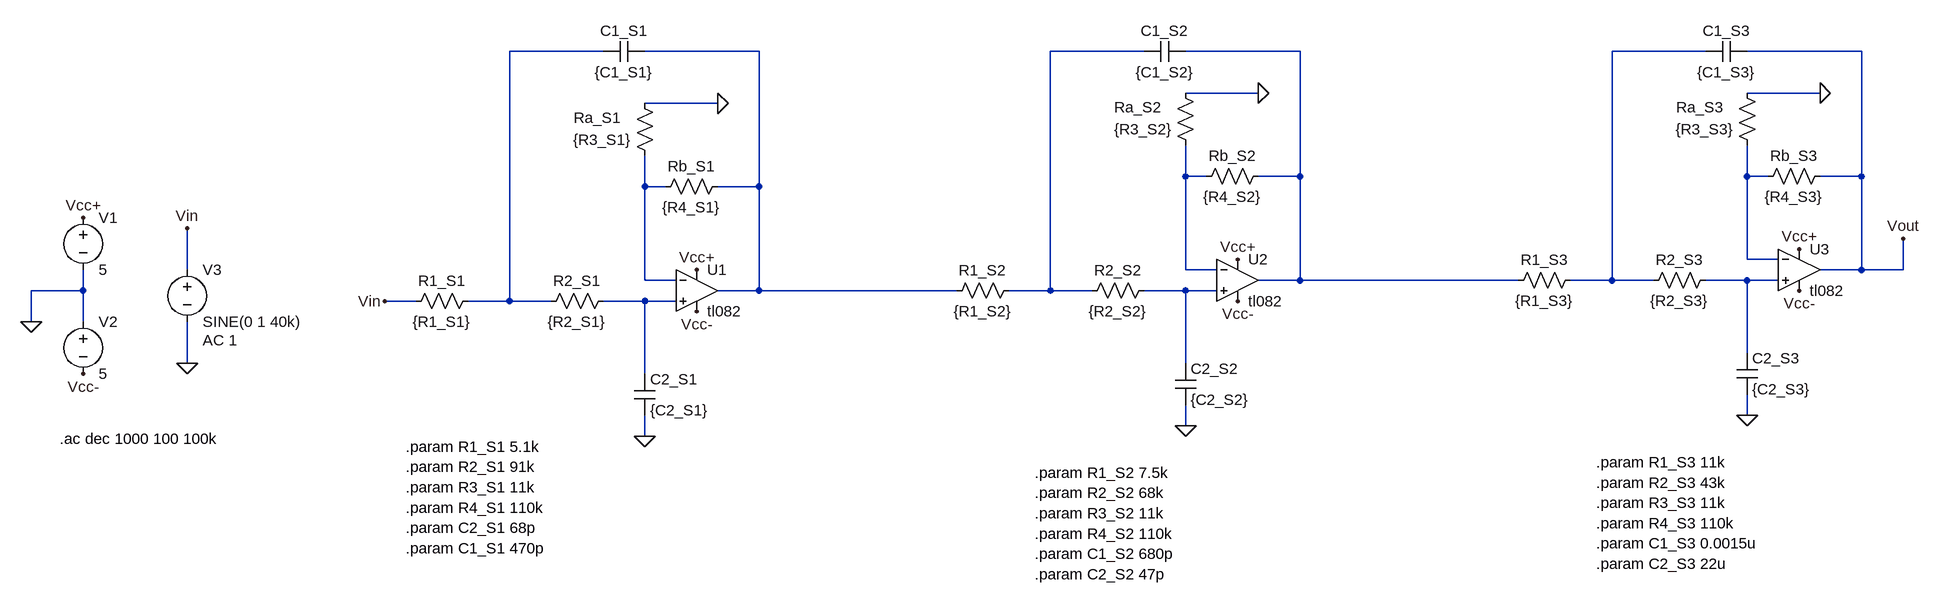
[diagram p0: schematic Filtro_V3.asc]
Filtro_V3.asc, the LTspice schematic file:
Version 4
SHEET 1 2064 680
WIRE 32 -256 -112 -256
WIRE 272 -256 96 -256
WIRE 864 -256 720 -256
WIRE 1104 -256 928 -256
WIRE 1728 -256 1584 -256
WIRE 1968 -256 1792 -256
WIRE 1040 -192 928 -192
WIRE 1904 -192 1792 -192
WIRE 208 -176 96 -176
WIRE 928 -64 928 -112
WIRE 960 -64 928 -64
WIRE 1104 -64 1104 -256
WIRE 1104 -64 1040 -64
WIRE 1792 -64 1792 -112
WIRE 1824 -64 1792 -64
WIRE 1968 -64 1968 -256
WIRE 1968 -64 1904 -64
WIRE 96 -48 96 -96
WIRE 128 -48 96 -48
WIRE 272 -48 272 -256
WIRE 272 -48 208 -48
WIRE 1792 64 1792 -64
WIRE 1840 64 1792 64
WIRE -608 80 -608 16
WIRE 928 80 928 -64
WIRE 976 80 928 80
WIRE 1968 80 1968 -64
WIRE 1968 80 1904 80
WIRE 2032 80 2032 32
WIRE 2032 80 1968 80
WIRE 96 96 96 -48
WIRE 144 96 96 96
WIRE 1104 96 1104 -64
WIRE 1104 96 1040 96
WIRE 1440 96 1104 96
WIRE 1584 96 1584 -256
WIRE 1584 96 1520 96
WIRE 1648 96 1584 96
WIRE 1792 96 1728 96
WIRE 1840 96 1792 96
WIRE -768 112 -768 80
WIRE -768 112 -848 112
WIRE 272 112 272 -48
WIRE 272 112 208 112
WIRE 576 112 272 112
WIRE 720 112 720 -256
WIRE 720 112 656 112
WIRE 784 112 720 112
WIRE 928 112 864 112
WIRE 976 112 928 112
WIRE -256 128 -304 128
WIRE -112 128 -112 -256
WIRE -112 128 -176 128
WIRE -48 128 -112 128
WIRE 96 128 32 128
WIRE 144 128 96 128
WIRE -848 160 -848 112
WIRE -768 160 -768 112
WIRE 1792 208 1792 96
WIRE -608 224 -608 160
WIRE 928 224 928 112
WIRE 96 240 96 128
WIRE 1792 304 1792 272
WIRE 928 320 928 288
WIRE 96 336 96 304
FLAG 96 336 0
FLAG -848 160 0
FLAG -768 0 Vcc+
FLAG -768 240 Vcc-
FLAG 176 80 Vcc+
FLAG 176 144 Vcc-
FLAG -304 128 Vin
FLAG -608 224 0
FLAG -608 16 Vin
FLAG 928 320 0
FLAG 1008 64 Vcc+
FLAG 1008 128 Vcc-
FLAG 1792 304 0
FLAG 1872 48 Vcc+
FLAG 1872 112 Vcc-
FLAG 2032 32 Vout
FLAG 208 -176 0
FLAG 1040 -192 0
FLAG 1904 -192 0
SYMBOL tl082 176 112 R0
SYMATTR InstName U1
SYMBOL res -160 112 R90
WINDOW 0 0 56 VBottom 2
WINDOW 3 32 56 VTop 2
SYMATTR InstName R1_S1
SYMATTR Value {R1_S1}
SYMBOL cap 80 240 R0
SYMATTR InstName C2_S1
SYMATTR Value {C2_S1}
SYMBOL cap 96 -272 R90
WINDOW 0 0 32 VBottom 2
WINDOW 3 32 32 VTop 2
SYMATTR InstName C1_S1
SYMATTR Value {C1_S1}
SYMBOL res 48 112 R90
WINDOW 0 0 56 VBottom 2
WINDOW 3 32 56 VTop 2
SYMATTR InstName R2_S1
SYMATTR Value {R2_S1}
SYMBOL voltage -768 -16 R0
SYMATTR InstName V1
SYMATTR Value 5
SYMBOL voltage -768 144 R0
SYMATTR InstName V2
SYMATTR Value 5
SYMBOL voltage -608 64 R0
WINDOW 123 24 124 Left 2
WINDOW 39 0 0 Left 0
SYMATTR InstName V3
SYMATTR Value SINE(0 1 40k)
SYMATTR Value2 AC 1
SYMBOL tl082 1008 96 R0
SYMATTR InstName U2
SYMBOL res 672 96 R90
WINDOW 0 0 56 VBottom 2
WINDOW 3 32 56 VTop 2
SYMATTR InstName R1_S2
SYMATTR Value {R1_S2}
SYMBOL cap 912 224 R0
SYMATTR InstName C2_S2
SYMATTR Value {C2_S2}
SYMBOL cap 928 -272 R90
WINDOW 0 0 32 VBottom 2
WINDOW 3 32 32 VTop 2
SYMATTR InstName C1_S2
SYMATTR Value {C1_S2}
SYMBOL res 880 96 R90
WINDOW 0 0 56 VBottom 2
WINDOW 3 32 56 VTop 2
SYMATTR InstName R2_S2
SYMATTR Value {R2_S2}
SYMBOL tl082 1872 80 R0
SYMATTR InstName U3
SYMBOL res 1536 80 R90
WINDOW 0 0 56 VBottom 2
WINDOW 3 32 56 VTop 2
SYMATTR InstName R1_S3
SYMATTR Value {R1_S3}
SYMBOL cap 1776 208 R0
SYMATTR InstName C2_S3
SYMATTR Value {C2_S3}
SYMBOL cap 1792 -272 R90
WINDOW 0 0 32 VBottom 2
WINDOW 3 32 32 VTop 2
SYMATTR InstName C1_S3
SYMATTR Value {C1_S3}
SYMBOL res 1744 80 R90
WINDOW 0 0 56 VBottom 2
WINDOW 3 32 56 VTop 2
SYMATTR InstName R2_S3
SYMATTR Value {R2_S3}
SYMBOL res 224 -64 R90
WINDOW 0 0 56 VBottom 2
WINDOW 3 32 56 VTop 2
SYMATTR InstName Rb_S1
SYMATTR Value {R4_S1}
SYMBOL res 112 -80 R180
WINDOW 0 52 74 Left 2
WINDOW 3 36 40 Left 2
SYMATTR InstName Ra_S1
SYMATTR Value {R3_S1}
SYMBOL res 1056 -80 R90
WINDOW 0 0 56 VBottom 2
WINDOW 3 32 56 VTop 2
SYMATTR InstName Rb_S2
SYMATTR Value {R4_S2}
SYMBOL res 944 -96 R180
WINDOW 0 52 74 Left 2
WINDOW 3 36 40 Left 2
SYMATTR InstName Ra_S2
SYMATTR Value {R3_S2}
SYMBOL res 1920 -80 R90
WINDOW 0 0 56 VBottom 2
WINDOW 3 32 56 VTop 2
SYMATTR InstName Rb_S3
SYMATTR Value {R4_S3}
SYMBOL res 1808 -96 R180
WINDOW 0 52 74 Left 2
WINDOW 3 36 40 Left 2
SYMATTR InstName Ra_S3
SYMATTR Value {R3_S3}
TEXT -272 352 Left 2 !.param R1_S1 5.1k\n.param R2_S1 91k\n.param R3_S1 11k\n.param R4_S1 110k\n.param C2_S1 68p\n.param C1_S1 470p
TEXT -804 340 Left 2 !.ac dec 1000 100 100k
TEXT 696 392 Left 2 !.param R1_S2 7.5k\n.param R2_S2 68k\n.param R3_S2 11k\n.param R4_S2 110k\n.param C1_S2 680p\n.param C2_S2 47p
TEXT 1560 376 Left 2 !.param R1_S3 11k\n.param R2_S3 43k\n.param R3_S3 11k\n.param R4_S3 110k\n.param C1_S3 0.0015u\n.param C2_S3 22u

The netlist it stands for:
* Filtro_V3.asc
* U1: tl082 (symbol tl082 not available, pins judged from their places): In+=N011 In-=N008 V+=Vcc+ V-=Vcc- OUT=N002
R1_S1 N001 Vin {R1_S1}
C2_S1 N011 0 {C2_S1}
C1_S1 N002 N001 {C1_S1}
R2_S1 N011 N001 {R2_S1}
V1 Vcc+ 0 5
V2 0 Vcc- 5
V3 Vin 0 SINE(0 1 40k) AC 1
* U2: tl082 (symbol tl082 not available, pins judged from their places): In+=N010 In-=N006 V+=Vcc+ V-=Vcc- OUT=N004
R1_S2 N003 N002 {R1_S2}
C2_S2 N010 0 {C2_S2}
C1_S2 N004 N003 {C1_S2}
R2_S2 N010 N003 {R2_S2}
* U3: tl082 (symbol tl082 not available, pins judged from their places): In+=N009 In-=N007 V+=Vcc+ V-=Vcc- OUT=Vout
R1_S3 N005 N004 {R1_S3}
C2_S3 N009 0 {C2_S3}
C1_S3 Vout N005 {C1_S3}
R2_S3 N009 N005 {R2_S3}
Rb_S1 N002 N008 {R4_S1}
Ra_S1 N008 0 {R3_S1}
Rb_S2 N004 N006 {R4_S2}
Ra_S2 N006 0 {R3_S2}
Rb_S3 Vout N007 {R4_S3}
Ra_S3 N007 0 {R3_S3}
.param R1_S1 5.1k
.param R2_S1 91k
.param R3_S1 11k
.param R4_S1 110k
.param C2_S1 68p
.param C1_S1 470p
.ac dec 1000 100 100k
.param R1_S2 7.5k
.param R2_S2 68k
.param R3_S2 11k
.param R4_S2 110k
.param C1_S2 680p
.param C2_S2 47p
.param R1_S3 11k
.param R2_S3 43k
.param R3_S3 11k
.param R4_S3 110k
.param C1_S3 0.0015u
.param C2_S3 22u
.backanno
.end